# EAGLE schematic led-cpu-rev1 (EAGLE 6.2)
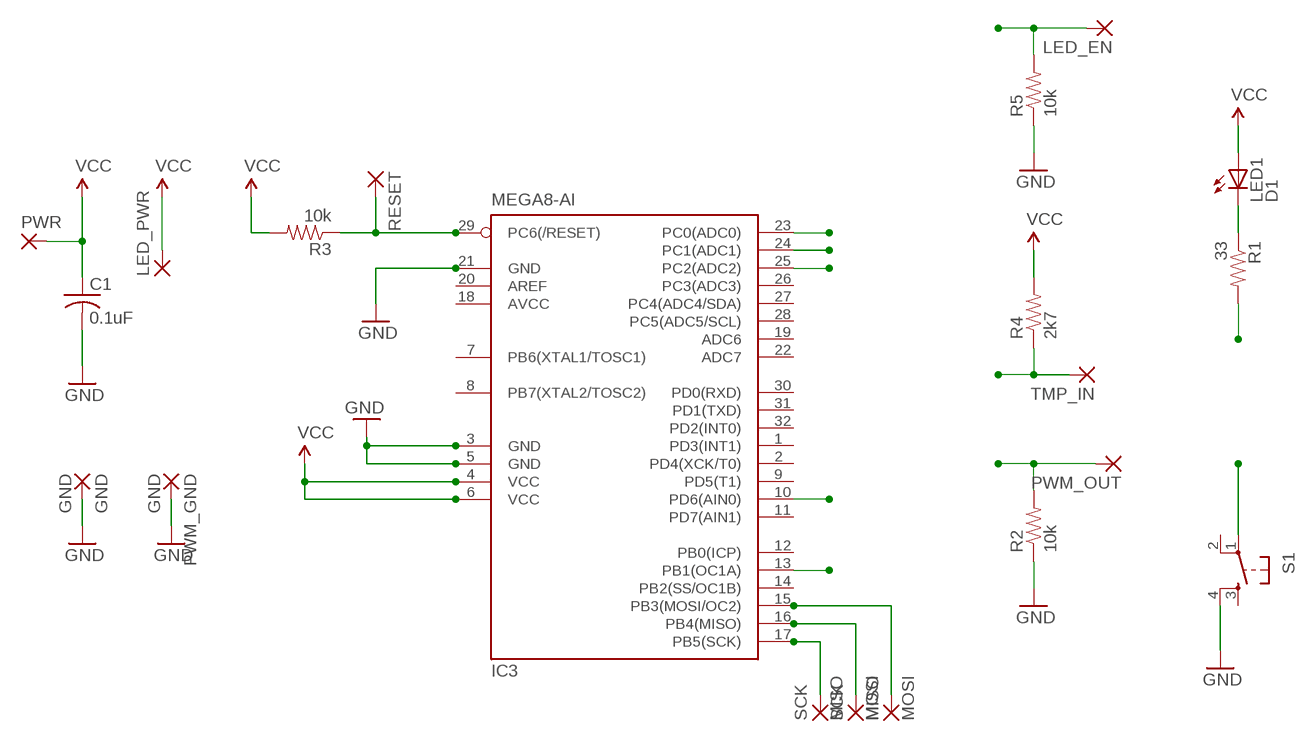
[diagram p0: schematic, sheet 1]

## Parts
C1  0.1uF  C-USC1206  [C1206]
GND  GND  SMD5  [SMD2,54-5,08]
IC3  MEGA8-AI  [TQFP32-08]
LED1  D1  LEDCHIPLED_1206  [CHIPLED_1206]
LED_EN  SMD5  [SMD2,54-5,08]
LED_PWR  SMD5  [SMD2,54-5,08]
MISO  MISO  SMD2  [SMD1,27-2,54]
MOSI  MOSI  SMD2  [SMD1,27-2,54]
PWM_GND  GND  SMD5  [SMD2,54-5,08]
PWM_OUT  SMD5  [SMD2,54-5,08]
PWR  SMD5  [SMD2,54-5,08]
R1  33  RESISTOR1206  [1206]
R2  10k  RESISTOR1206  [1206]
R3  10k  RESISTOR1206  [1206]
R4  2k7  RESISTOR1206  [1206]
R5  10k  RESISTOR1206  [1206]
RESET  SMD2  [SMD1,27-2,54]
S1  TAC_SWITCHPTH  [TACTILE-PTH]
SCK  SCK  SMD2  [SMD1,27-2,54]
TMP_IN  SMD5  [SMD2,54-5,08]

## Nets
GND: C1.2 GND.1(P) IC3.3(GND) IC3.5(GND) IC3.21(GND) PWM_GND.1(P) R2.1 R5.1 S1.4
LED_EN: IC3.25(PC2(ADC2)) LED_EN.1(P) R5.2
MISO: IC3.16(PB4(MISO)) MISO.1(P)
MOSI: IC3.15(PB3(MOSI/OC2)) MOSI.1(P)
N$1: LED1.C R1.1
PWM_OUT: IC3.10(PD6(AIN0)) PWM_OUT.1(P) R2.2
PWR_LED: IC3.13(PB1(OC1A)) R1.2
PWR_SW: IC3.24(PC1(ADC1)) S1.1
RESET: IC3.29(PC6(/RESET)) R3.1 RESET.1(P)
SCK: IC3.17(PB5(SCK)) SCK.1(P)
TMP_IN: IC3.23(PC0(ADC0)) R4.1 TMP_IN.1(P)
VCC: C1.1 IC3.4(VCC) IC3.6(VCC) LED1.A LED_PWR.1(P) PWR.1(P) R3.2 R4.2
Unconnected: IC3.1(PD3(INT1)) IC3.2(PD4(XCK/T0)) IC3.7(PB6(XTAL1/TOSC1)) IC3.8(PB7(XTAL2/TOSC2)) IC3.9(PD5(T1)) IC3.11(PD7(AIN1)) IC3.12(PB0(ICP)) IC3.14(PB2(SS/OC1B)) IC3.19(ADC6) IC3.20(AREF) IC3.22(ADC7) IC3.26(PC3(ADC3)) IC3.27(PC4(ADC4/SDA)) IC3.28(PC5(ADC5/SCL)) IC3.30(PD0(RXD)) IC3.31(PD1(TXD)) IC3.32(PD2(INT0)) S1.2 S1.3

## Power pins joined to a net without a drawn wire
AVCC: IC3.18(AVCC)

## Library data of the parts
C1 = resistor:C-US: CAPACITOR, American symbol
GND LED_EN LED_PWR PWM_GND PWM_OUT PWR TMP_IN = wirepad:SMD5: SMD PAD
IC3 = atmel:MEGA8: MICROCONTROLLER 8 Kbytes FLASH, 1 kbytes SRAM, 512 bytes EEPROM, USART, 6-channel 10 bit ADC, 2-channel 8 bit ADC Pin compatible with Atmega48, ATMega88, ATMega168 Source: avr.lbr; MPN: ATMEGA8-16AU; OC_FARNELL: 9171371; OC_NEWARK: 73M8863
LED1 = led:LED: LED OSRAM: - CHIPLED LG R971, LG N971, LY N971, LG Q971, LY Q971, LO R971, LY R971 LH N974, LH R974 LS Q976, LO Q976, LY Q976 LO Q996 - Hyper CHIPLED LW Q18S LB Q993, LB Q99A, LB R99A - SideLED LS A670, LO A670, LY A670, LG A670, LP A670 LB A673, LV A673, LT A673, LW A673 LH A674 LY A675 LS A676, LA A676, LO A676, LY A676, LW A676 LS A679, LY A679, LG A679 - Hyper Micro SIDELED® LS Y876, LA Y876, LO Y876, LY Y876 LT Y87S - SmartLED LW L88C, LW L88S LB L89C, LB L89S, LG L890 LS L89K, LO L89K, LY L89K LS L896, LA L896, LO L896, LY L896 - TOPLED LS T670, LO T670, LY T670, LG T670, LP T670 LSG T670, LSP T670, LSY T670, LOP T670, LYG T670 LG T671, LOG T671, LSG T671 LB T673, LV T673, LT T673, LW T673 LH T674 LS T676, LA T676, LO T676, LY T676, LB T676, LH T676, LSB T676, LW T676 LB T67C, LV T67C, LT T67C, LS T67K, LO T67K, LY T67K, LW E67C LS E67B, LA E67B, LO E67B, LY E67B, LB E67C, LV E67C, LT E67C LW T67C LS T679, LY T679, LG T679 LS T770, LO T770, LY T770, LG T770, LP T770 LB T773, LV T773, LT T773, LW T773 LH T774 LS E675, LA E675, LY E675, LS T675 LS T776, LA T776, LO T776, LY T776, LB T776 LHGB T686 LT T68C, LB T68C - Hyper Mini TOPLED® LB M676 - Mini TOPLED Santana® LG M470 LS M47K, LO M47K, LY M47K Source: http://www.osram.convergy.de LUXEON: - LUMILED® LXK2-PW12-R00, LXK2-PW12-S00, LXK2-PW14-U00, LXK2-PW14-V00 LXK2-PM12-R00, LXK2-PM12-S00, LXK2-PM14-U00 LXK2-PE12-Q00, LXK2-PE12-R00, LXK2-PE12-S00, LXK2-PE14-T00, LXK2-PE14-U00 LXK2-PB12-K00, LXK2-PB12-L00, LXK2-PB12-M00, LXK2-PB14-N00, LXK2-PB14-P00, LXK2-PB14-Q00 LXK2-PR12-L00, LXK2-PR12-M00, LXK2-PR14-Q00, LXK2-PR14-R00 LXK2-PD12-Q00, LXK2-PD12-R00, LXK2-PD12-S00 LXK2-PH12-R00, LXK2-PH12-S00 LXK2-PL12-P00, LXK2-PL12-Q00, LXK2-PL12-R00 Source: www.luxeon.com KINGBRIGHT: KA-3528ASYC Source: www.kingbright.com
MISO MOSI RESET SCK = wirepad:SMD2: SMD PAD
R1-R5 = SparkFun:RESISTOR: Resistor Basic schematic elements and footprints for 0603, 1206, and PTH resistors.
S1 = SparkFun:TAC_SWITCH: Momentary Switch Button commonly used for reset or general input. Spark Fun Electronics SKU : COM-00097